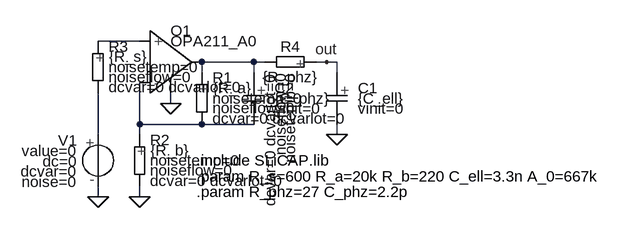
[diagram p0: schematic myFirstVampOPA211compensated.asc]
myFirstVampOPA211compensated.asc, the LTspice schematic file:
Version 4
SHEET 1 880 680
WIRE 160 112 96 112
WIRE 336 144 256 144
WIRE 352 144 336 144
WIRE 448 144 432 144
WIRE 464 144 448 144
WIRE 256 160 256 144
WIRE 336 160 336 144
WIRE 464 160 464 144
WIRE 208 208 208 192
WIRE 160 240 160 176
WIRE 256 240 160 240
WIRE 336 240 256 240
WIRE 96 256 96 192
WIRE 160 256 160 240
WIRE 464 256 464 240
WIRE 96 352 96 336
WIRE 160 352 160 336
FLAG 208 208 0
FLAG 464 256 0
FLAG 96 352 0
FLAG 160 352 0
FLAG 448 144 out
SYMBOL SLO 176 144 R0
SYMATTR InstName O1
SYMATTR Value OPA211_A0
SYMBOL SLR 256 160 R0
SYMATTR InstName R1
SYMATTR Value {R_a}
SYMBOL SLR 160 256 R0
SYMATTR InstName R2
SYMATTR Value {R_b}
SYMBOL SLR 96 112 R0
SYMATTR InstName R3
SYMATTR Value {R_s}
SYMBOL SLV 96 256 M0
SYMATTR InstName V1
SYMBOL SLC 464 160 R0
SYMATTR InstName C1
SYMATTR Value {C_ell}
SYMBOL SLR 432 144 R90
WINDOW 0 -8 40 VBottom 2
WINDOW 3 8 40 VTop 2
SYMATTR InstName R4
SYMATTR Value {R_phz}
SYMBOL SLC 336 160 R0
SYMATTR InstName C2
SYMATTR Value {C_phz}
TEXT 248 296 Left 2 !.include SLiCAP.lib
TEXT 248 320 Left 2 !.param R_s=600 R_a=20k R_b=220 C_ell=3.3n A_0=667k
TEXT 248 344 Left 2 !.param R_phz=27 C_phz=2.2p

The netlist it stands for:
* myFirstVampOPA211compensated.asc
O1 N001 N003 N002 0 OPA211_A0
R1 N002 N003 R {R_a} noisetemp=0 noiseflow=0 dcvar=0 dcvarlot=0
R2 N003 0 R {R_b} noisetemp=0 noiseflow=0 dcvar=0 dcvarlot=0
R3 N001 N004 R {R_s} noisetemp=0 noiseflow=0 dcvar=0 dcvarlot=0
V1 N004 0 V value=0 dc=0 dcvar=0 noise=0
C1 out 0 C {C_ell} vinit=0
R4 out N002 R {R_phz} noisetemp=0 noiseflow=0 dcvar=0 dcvarlot=0
C2 N002 N003 C {C_phz} vinit=0
.include SLiCAP.lib
.param R_s=600 R_a=20k R_b=220 C_ell=3.3n A_0=667k
.param R_phz=27 C_phz=2.2p
.backanno
.end